# EAGLE design alarmClock (EAGLE 8.5.1)
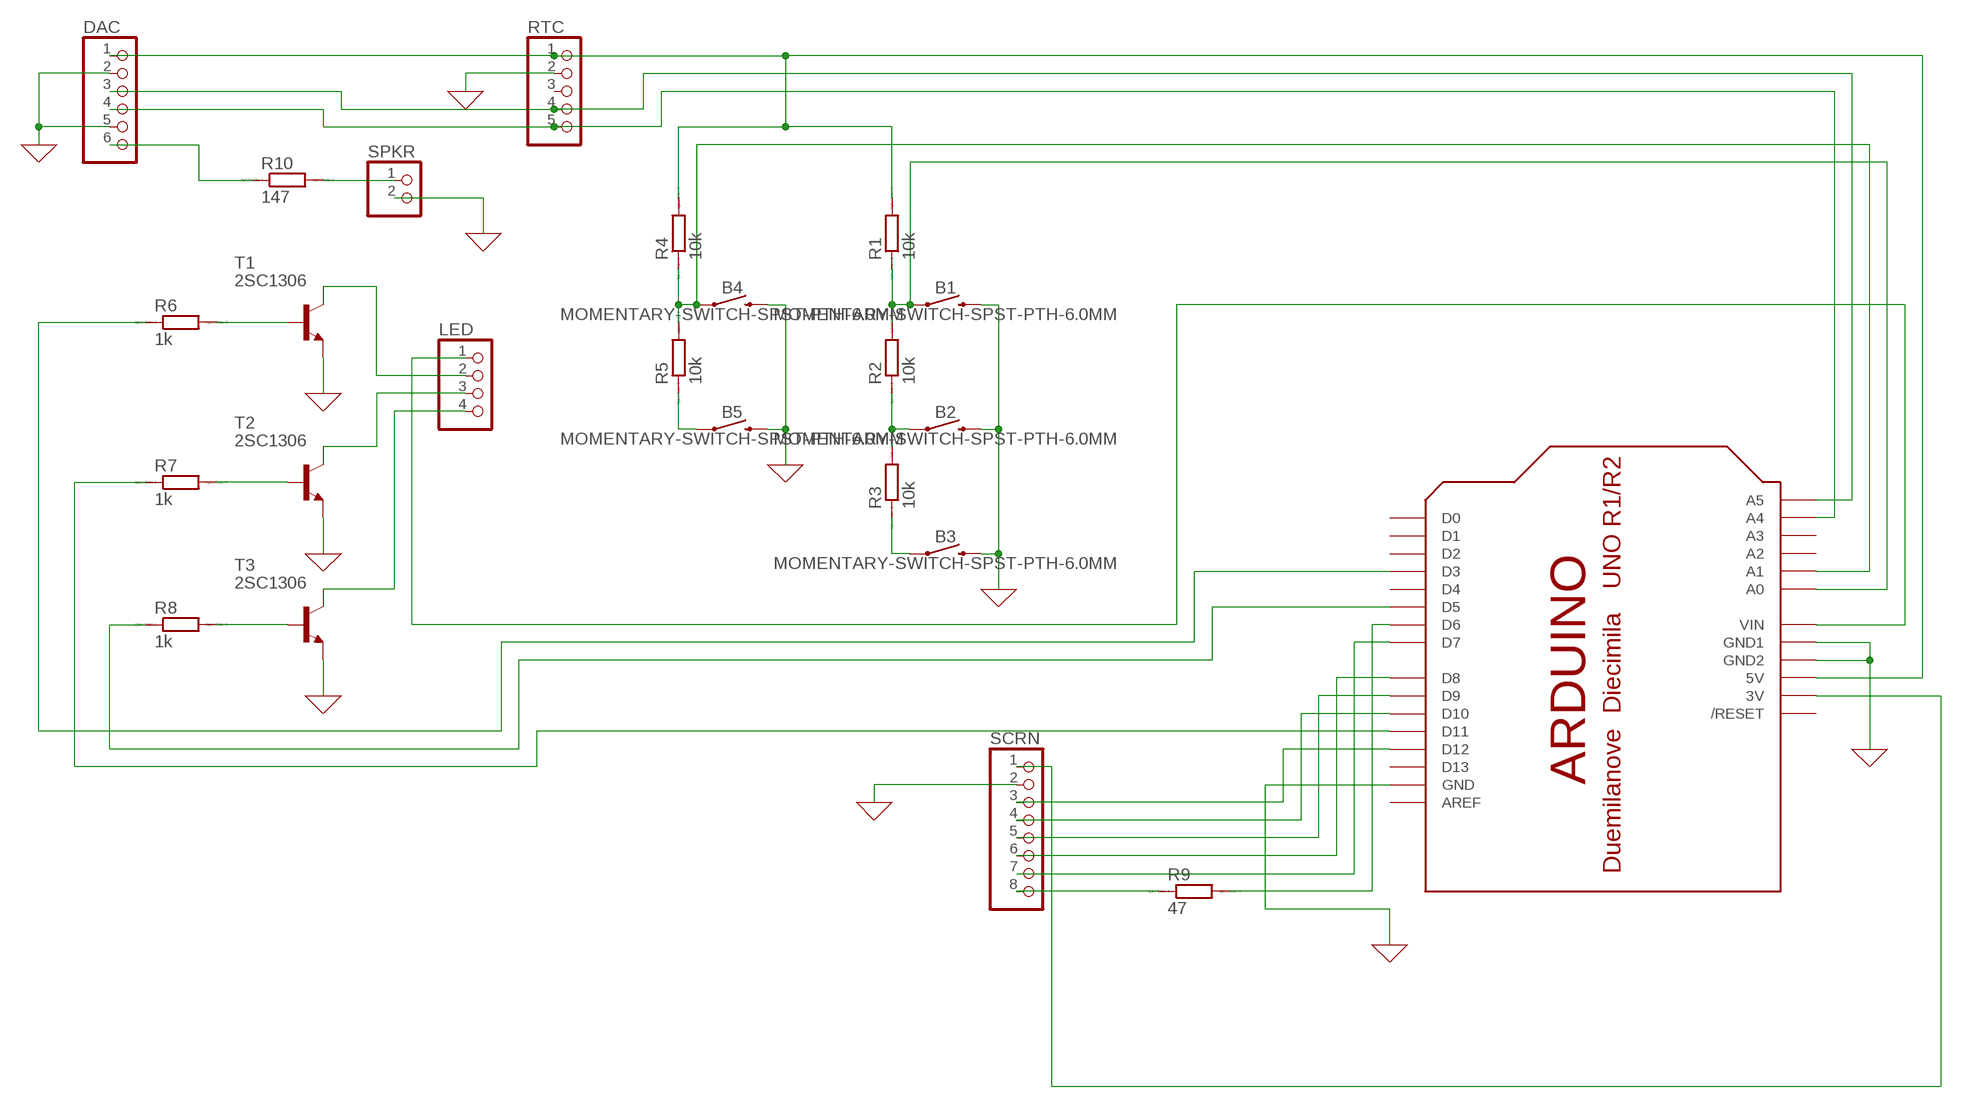
[diagram p0: schematic, sheet 1]

## Parts
B1  MOMENTARY-SWITCH-SPST-PTH-6.0MM  [TACTILE_SWITCH_PTH_6.0MM]
B2  MOMENTARY-SWITCH-SPST-PTH-6.0MM  [TACTILE_SWITCH_PTH_6.0MM]
B3  MOMENTARY-SWITCH-SPST-PTH-6.0MM  [TACTILE_SWITCH_PTH_6.0MM]
B4  MOMENTARY-SWITCH-SPST-PTH-6.0MM  [TACTILE_SWITCH_PTH_6.0MM]
B5  MOMENTARY-SWITCH-SPST-PTH-6.0MM  [TACTILE_SWITCH_PTH_6.0MM]
DAC  PINHD-1X6  [1X06]
LED  PINHD-1X4  [1X04]
R1  10k  R0204/7  [0204/7]
R2  10k  R0204/7  [0204/7]
R3  10k  R0204/7  [0204/7]
R4  10k  R0204/7  [0204/7]
R5  10k  R0204/7  [0204/7]
R6  1k  R0204/7  [0204/7]
R7  1k  R0204/7  [0204/7]
R8  1k  R0204/7  [0204/7]
R9  47  R0204/7  [0204/7]
R10  147  R0204/7  [0204/7]
RTC  PINHD-1X5  [1X05]
SCRN  PINHD-1X8  [1X08]
SPKR  PINHD-1X2  [1X02]
T1  2SC1306  [TO220BV]
T2  2SC1306  [TO220BV]
T3  2SC1306  [TO220BV]
U$1  ARDUINOUNO  [ARDUINO]

## Nets
0: B1.3 B2.3 B3.3 B4.3 B5.3 DAC.2 DAC.5 RTC.2 SCRN.2 SPKR.2 T1.3(E) T2.3(E) T3.3(E) U$1.GND U$1.GND1 U$1.GND2 ; supply symbol labelled GND
N$1: B1.1 R1.1 R2.2 U$1.A0
N$2: B3.1 R3.1
N$3: B2.1 R2.1 R3.2
N$4: B5.1 R5.1
N$5: B4.1 R4.1 R5.2 U$1.A1
N$6: R6.2 T1.1(B)
N$7: R8.2 T3.1(B)
N$8: R7.2 T2.1(B)
N$9: DAC.4 RTC.5 U$1.A4
N$10: DAC.3 RTC.4 U$1.A5
N$11: DAC.1 R1.2 R4.2 RTC.1 U$1.5V
N$12: DAC.6 R10.1
N$13: LED.1 U$1.VIN
N$14: LED.2 T1.2(C)
N$15: LED.4 T3.2(C)
N$16: LED.3 T2.2(C)
N$17: R6.1 U$1.D3
N$18: R8.1 U$1.D5
N$19: SCRN.7 U$1.D7
N$20: R9.2 U$1.D6
N$22: SCRN.6 U$1.D8
N$23: R7.1 U$1.D11
N$24: SCRN.5 U$1.D9
N$25: SCRN.4 U$1.D10
N$26: SCRN.3 U$1.D12
N$27: SCRN.1 U$1.3V
N$28: R9.1 SCRN.8
N$29: R10.2 SPKR.1
Unconnected: RTC.3 U$1.A2 U$1.A3 U$1.AREF U$1.D0 U$1.D1 U$1.D2 U$1.D4 U$1.D13 U$1.RESET(/RESET)

## Library data of the parts
B1-B5 = SparkFun-Switches:MOMENTARY-SWITCH-SPST: Momentary Switch (Pushbutton) - SPST Normally-open (NO) SPST momentary switches (buttons, pushbuttons). Variants PTH-12MM - 12mm square, through-hole Momentary Pushbutton Switch - 12mm Square <https://www.sparkfun.com/products/9190> (COM-09190) PTH-6.0MM, PTH-6.0MM-KIT - 6.0mm square, through-hole Mini Pushbutton Switch <https://www.sparkfun.com/products/97> (COM-00097) KIT package intended for soldering kit's - only one side of pads' copper is exposed. PTH-RIGHT-ANGLE-KIT - Right-angle, through-hole Right Angle Tactile Button <https://www.sparkfun.com/products/10791> - Used on SparkFun BigTime Watch Kit <https://www.sparkfun.com/products/11734> SMD-12MM - 12mm square, surface-mount Tactile Button - SMD (12mm) <https://www.sparkfun.com/products/12993> (COM-12993) Used on SparkFun PicoBoard <https://www.sparkfun.com/products/11888> SMD-4.5MM - 4.5mm Square Trackball Switch Used on SparkFun Blackberry Trackballer Breakout <https://www.sparkfun.com/products/13169> SMD-4.6MMX2.8MM - 4.60mm x 2.80mm, surface mount Used on SparkFun SAMD21 Mini Breakout <https://www.sparkfun.com/products/13664> SMD-5.2MM, SMD-5.2-REDUNDANT - 5.2mm square, surface-mount Mini Pushbutton Switch - SMD <https://www.sparkfun.com/products/8720> (COM-08720) Used on Arduino Pro Mini <https://www.sparkfun.com/products/11114> REDUNDANT package connects both switch circuits together SMD-6.0X3.5MM - 6.0 x 3.5mm, surface mount Momentary Reset Switch SMD <https://www.sparkfun.com/products/8229> (COM-08229) SMD-6.2MM-TALL - 6.2mm square, surface mount Tactile Button - SMD (6mm) <https://www.sparkfun.com/products/12992> Used on SparkFun Digital Sandbox <https://www.sparkfun.com/products/12651> SMD-RIGHT-ANGLE - Right-angle, surface mount Used on SparkFun Block for Intel® Edison - Arduino <https://www.sparkfun.com/products/13036>; PROD_ID: SWCH-08441; SF_SKU: COM-00097
DAC = pinhead:PINHD-1X6: PIN HEADER
LED = pinhead:PINHD-1X4: PIN HEADER
R1-R10 = eagle-ltspice:R: RESISTOR, European symbol; SPICEMODEL: NONE; SPICEPREFIX: R
RTC = pinhead:PINHD-1X5: PIN HEADER
SCRN = pinhead:PINHD-1X8: PIN HEADER
SPKR = pinhead:PINHD-1X2: PIN HEADER
T1-T3 = transistor:2SC1306: NPN Transistor Final RF Power Outupt Source: 2sc1306.pdf
U$1 = adafruit:ARDUINO: Arduino Diecimila/Duemilanove Make a shield with ease, this package has all the named pins as well as the two mounting drill holes and an outline of the USB and DC power connector. The outline is on the DIMENSION layer, so if your board house uses it they will cut the outline to match. http://www.ladyada.net/library/pcb/eaglelibrary.html

## Board
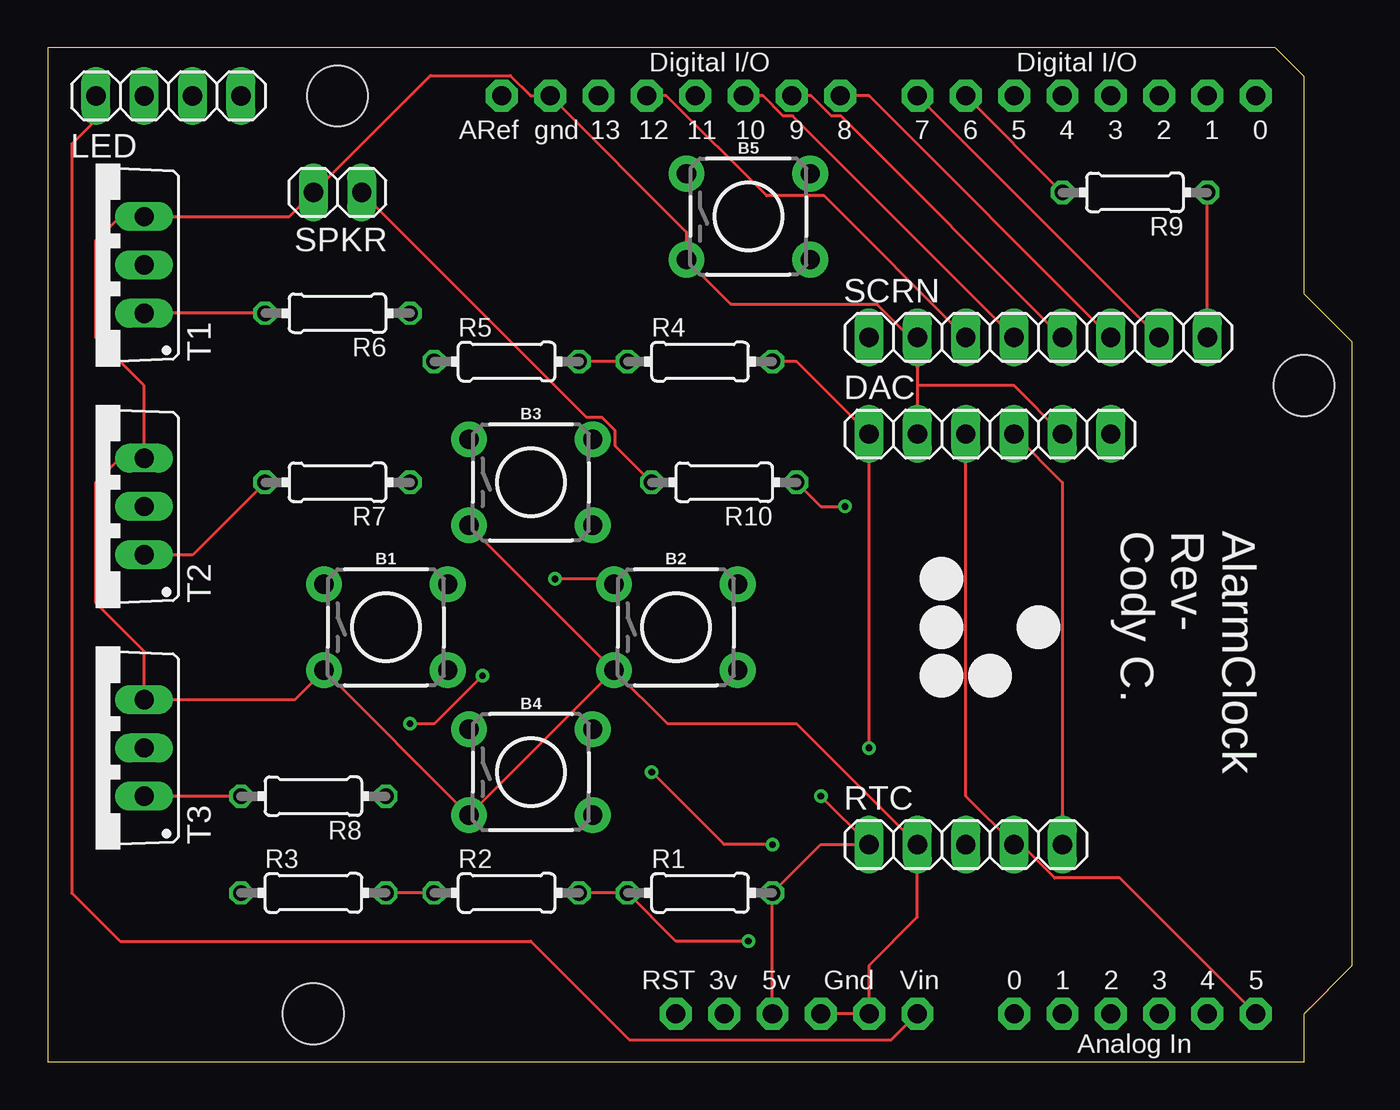
[diagram p1: board, top side]
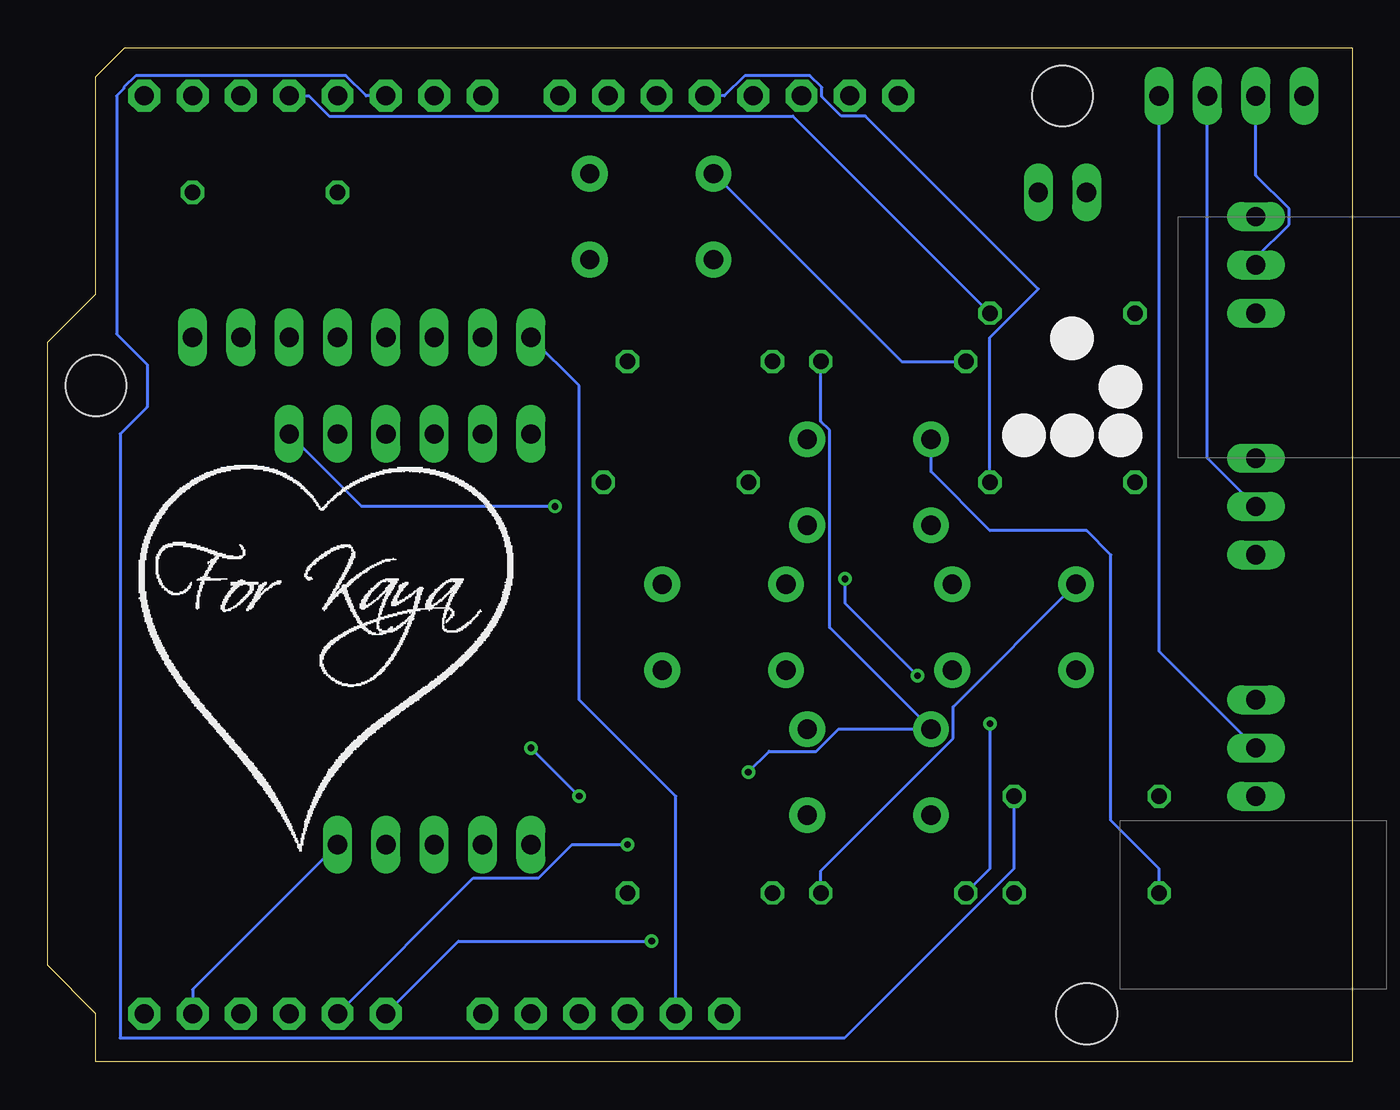
[diagram p2: board, bottom side, seen from below]

Size 68.58 x 53.34 mm. Coordinates in mm from the lower left corner, seen from the top.
Copper layers (1*16): Top 0.0356mm / dielectric 1.5011mm / Bottom 0.0356mm
Design rules "LaenPCBOrder": minimum track width 6mil, minimum drill 13mil, track to track 6mil, track to pad 6mil, pad to pad 6mil, via to via 6mil, smd to smd 6mil, copper to edge 15mil, drill to drill 6mil, minimum pad ring 7mil, minimum via ring 7mil, stop-mask expansion 4mil, vias tented up to drill 0mil, thermal gap 10mil

### Footprints (pad centres in the part's own frame; a part is rotated, then mirrored left to right if it is on the bottom)
TACTILE_SWITCH_PTH_6.0MM = drill 1.016 pad 1.88: 1 -3.251,2.261; 2 3.251,2.261; 3 -3.251,-2.261; 4 3.251,-2.261
1X06 = drill 1.016 long: 1 -6.35,0; 2 -3.81,0; 3 -1.27,0; 4 1.27,0; 5 3.81,0; 6 6.35,0
1X04 = drill 1.016 long: 1 -3.81,0; 2 -1.27,0; 3 1.27,0; 4 3.81,0
0204/7 = drill 0.813 octagon: 1 -3.81,0; 2 3.81,0
1X05 = drill 1.016 long: 1 -5.08,0; 2 -2.54,0; 3 0,0; 4 2.54,0; 5 5.08,0
1X08 = drill 1.016 long: 1 -8.89,0; 2 -6.35,0; 3 -3.81,0; 4 -1.27,0; 5 1.27,0; 6 3.81,0; 7 6.35,0; 8 8.89,0
1X02 = drill 1.016 long: 1 -1.27,0; 2 1.27,0
TO220BV = drill 1.016 long: 1 -2.54,-2.54; 2 0,-2.54; 3 2.54,-2.54
ARDUINO = drill 1 pad 1.676 octagon: 3V 35.56,2.54; 5V 38.1,2.54; A0 50.8,2.54; A1 53.34,2.54; A2 55.88,2.54; A3 58.42,2.54; A4 60.96,2.54; A5 63.5,2.54; AREF 23.876,50.8; D0 63.5,50.8; D1 60.96,50.8; D2 58.42,50.8; D3 55.88,50.8; D4 53.34,50.8; D5 50.8,50.8; D6 48.26,50.8; D7 45.72,50.8; D8 41.656,50.8; D9 39.116,50.8; D10 36.576,50.8; D11 34.036,50.8; D12 31.496,50.8; D13 28.956,50.8; GND 26.416,50.8; GND1 43.18,2.54; GND2 40.64,2.54; RESET 33.02,2.54; VIN 45.72,2.54 | hole 3.2: 15.24,50.8; 66.04,35.56; 13.97,2.54

### Placement (x,y rotation side)
B1  17.78,22.86 0 top
B2  33.02,22.86 0 top
B3  25.4,30.48 0 top
B4  25.4,15.24 0 top
B5  36.83,44.45 0 top
DAC  49.53,33.02 0 top
LED  6.35,50.8 0 top
R1  34.29,8.89 0 top
R2  24.13,8.89 0 top
R3  13.97,8.89 0 top
R4  34.29,36.83 0 top
R5  24.13,36.83 0 top
R6  15.24,39.37 180 top
R7  15.24,30.48 180 top
R8  13.97,13.97 180 top
R9  57.15,45.72 180 top
R10  35.56,30.48 180 top
RTC  48.26,11.43 0 top
SCRN  52.07,38.1 0 top
SPKR  15.24,45.72 180 top
T1  2.54,41.91 90 top
T2  2.54,29.21 90 top
T3  2.54,16.51 90 top
U$1  0,0 0 top

### Tracks (layer width: path | path; a pad name or v marks a point on that pad's centre or on a via)
0
  Top 0.152: U$1.GND2 U$1.GND1 43.18,5.08 45.72,7.62 RTC.2 39.37,17.78 32.59,17.78 B2.3 | B2.3 B4.3 B1.3 12.98,19.05 T3.3 5.08,21.59 2.54,24.13 2.54,30.48 3.81,31.75 T2.3 5.08,35.56 2.54,38.1 2.54,43.18 3.81,44.45 T1.3 12.7,44.45 SPKR.2 20.12,51.87 24.32,51.87 25.39,50.8 U$1.GND 33.58,43.64 B5.3 35.92,39.85 43.59,39.85 45.34,38.1 SCRN.2 45.72,35.56 | 45.72,35.56 DAC.2 | DAC.5 50.8,35.56 45.72,35.56 | B2.3 B3.3
N$1  (via drill 0.35)
  Top 0.152: R2.2 R1.1 33.02,6.35 v36.83,6.35
  Bottom 0.152: B1.1 20.98,18.67 20.98,17.02 27.94,10.06 R2.2 | U$1.A0 46.99,6.35 v36.83,6.35
N$2
  Bottom 0.152: R3.1 10.16,10.16 12.7,12.7 12.7,26.67 13.97,27.94 19.05,27.94 22.15,31.04 B3.1
N$3  (via drill 0.35)
  Top 0.152: R2.1 R3.2 | B2.1 29.49,25.4 v26.67,25.4 | v22.86,20.32 20.32,17.78 v19.05,17.78
  Bottom 0.152: v26.67,25.4 26.67,24.13 v22.86,20.32 | v19.05,17.78 19.05,10.16 R2.1
N$4
  Bottom 0.152: B5.1 23.7,36.83 R5.1
N$5  (via drill 0.35)
  Top 0.152: R4.1 R5.2 | v38.1,11.43 35.56,11.43 v31.75,15.24
  Bottom 0.152: U$1.A1 46.2,9.68 42.77,9.68 41.02,11.43 v38.1,11.43 | v31.75,15.24 30.66,16.33 28.17,16.33 27,17.5 B4.1 27.48,22.84 27.48,33.22 27.94,33.68 R5.2
N$6
  Top 0.152: R6.2 T1.1
N$7
  Top 0.152: R8.2 T3.1
N$8
  Top 0.152: R7.2 7.62,26.67 T2.1
N$9
  Top 0.152: DAC.4 53.34,30.48 RTC.5
  Bottom 0.152: RTC.5 60.96,3.81 U$1.A4
N$10
  Top 0.152: U$1.A5 56.36,9.68 52.93,9.68 51.18,11.43 RTC.4 48.26,13.97 DAC.3
N$11  (via drill 0.35)
  Top 0.152: U$1.5V R1.2 40.64,11.43 RTC.1 v40.64,13.97 | v43.18,16.51 DAC.1 39.37,36.83 R4.2
  Bottom 0.152: v40.64,13.97 v43.18,16.51
N$12  (via drill 0.35)
  Top 0.152: R10.1 40.64,29.21 v41.91,29.21
  Bottom 0.152: v41.91,29.21 52.07,29.21 DAC.6
N$13
  Top 0.152: LED.1 2.54,49.53 1.27,48.26 1.27,8.89 3.81,6.35 25.4,6.35 30.58,1.17 44.35,1.17 U$1.VIN
N$14
  Bottom 0.152: T1.2 5.08,42.29 3.33,44.04 3.33,44.86 5.08,46.61 LED.2
N$15
  Bottom 0.152: T3.2 10.16,21.59 LED.4
N$16
  Bottom 0.152: T2.2 7.62,31.75 LED.3
N$17
  Bottom 0.152: U$1.D3 54.85,50.8 53.78,49.73 29.41,49.73 R6.1
N$18
  Bottom 0.152: U$1.D5 51.83,50.8 52.9,51.87 63.94,51.87 64.57,51.24 64.57,51.18 64.95,50.8 64.95,38.27 63.35,36.67 63.35,34.45 64.77,33.02 64.77,1.27 26.68,1.27 17.78,10.17 R8.1
N$19
  Top 0.152: SCRN.7 U$1.D7
N$20
  Top 0.152: R9.2 U$1.D6
N$22
  Top 0.152: SCRN.6 43.18,50.8 U$1.D8
N$23
  Bottom 0.152: R7.1 19.05,38.1 16.51,40.64 25.6,49.73 26.86,49.73 27.89,50.76 27.89,51.24 28.51,51.87 31.94,51.87 33,50.8 U$1.D11
N$24
  Top 0.152: SCRN.5 41.71,49.73 41.21,49.73 40.15,50.8 U$1.D9
N$25
  Top 0.152: SCRN.4 39.17,49.73 38.67,49.73 37.61,50.8 U$1.D10
N$26
  Top 0.152: SCRN.3 40.82,45.54 37.78,45.54 32.53,50.8 U$1.D12
N$27
  Bottom 0.152: U$1.3V 35.56,13.97 40.64,19.05 40.64,35.56 SCRN.1
N$28
  Top 0.152: SCRN.8 R9.1
N$29
  Top 0.152: SPKR.1 28.32,33.91 29.14,33.91 29.82,33.22 29.82,32.41 R10.2

### Text on the board
tPlace: AlarmClock / Rev- / Cody C.
bValues: C:/Users/test/Documents/Arduino/Sketches/alarmClock/heart-320.bmp
_bValues: C:/Users/test/Documents/Arduino/Sketches/alarmClock/forkaya.bmp